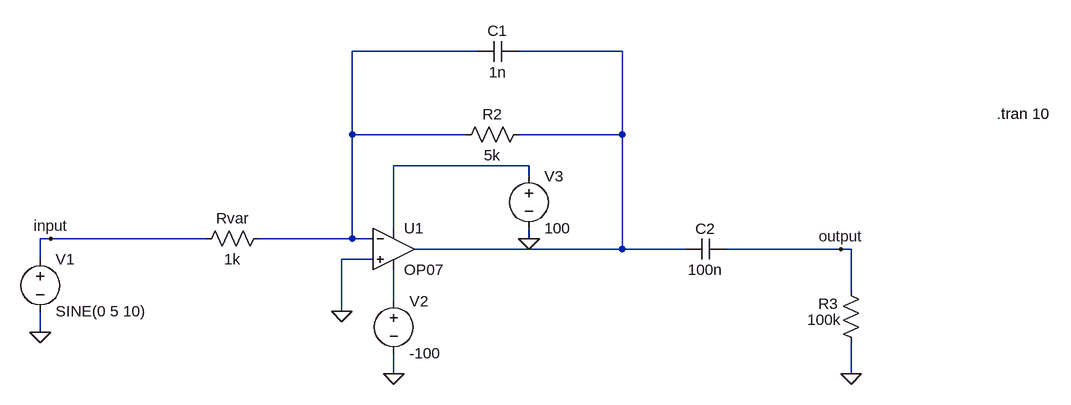
[diagram p0: schematic Tremolo.asc]
Tremolo.asc, the LTspice schematic file:
Version 4
SHEET 1 1456 680
WIRE 288 -112 96 -112
WIRE 512 -112 352 -112
WIRE 96 16 96 -112
WIRE 272 16 96 16
WIRE 512 16 512 -112
WIRE 512 16 352 16
WIRE 368 64 160 64
WIRE 368 80 368 64
WIRE 160 160 160 64
WIRE -368 176 -384 176
WIRE -128 176 -368 176
WIRE 96 176 96 16
WIRE 96 176 -48 176
WIRE 128 176 96 176
WIRE 368 176 368 160
WIRE 512 192 512 16
WIRE 512 192 192 192
WIRE 608 192 512 192
WIRE 848 192 672 192
WIRE 864 192 848 192
WIRE -384 208 -384 176
WIRE 128 208 80 208
WIRE 864 256 864 192
WIRE 160 272 160 224
WIRE 80 288 80 208
WIRE -384 320 -384 288
WIRE 160 384 160 352
WIRE 864 384 864 336
FLAG 80 288 0
FLAG 864 384 0
FLAG -384 320 0
FLAG 848 192 output
FLAG -368 176 input
FLAG 368 176 0
FLAG 160 384 0
SYMBOL res -32 160 R90
WINDOW 0 0 56 VBottom 2
WINDOW 3 32 56 VTop 2
SYMATTR InstName Rvar
SYMATTR Value 1k
SYMBOL res 368 0 R90
WINDOW 0 0 56 VBottom 2
WINDOW 3 32 56 VTop 2
SYMATTR InstName R2
SYMATTR Value 5k
SYMBOL res 880 352 R180
WINDOW 0 36 76 Left 2
WINDOW 3 31 51 Left 2
SYMATTR InstName R3
SYMATTR Value 100k
SYMBOL cap 352 -128 R90
WINDOW 0 0 32 VBottom 2
WINDOW 3 32 32 VTop 2
SYMATTR InstName C1
SYMATTR Value 1n
SYMBOL cap 672 176 R90
WINDOW 0 0 32 VBottom 2
WINDOW 3 32 32 VTop 2
SYMATTR InstName C2
SYMATTR Value 100n
SYMBOL voltage -384 192 R0
WINDOW 123 0 0 Left 0
WINDOW 39 0 0 Left 0
SYMATTR InstName V1
SYMATTR Value SINE(0 5 10)
SYMBOL OP07 160 128 R0
SYMATTR InstName U1
SYMBOL voltage 160 256 R0
SYMATTR InstName V2
SYMATTR Value -100
SYMBOL voltage 368 64 R0
WINDOW 123 0 0 Left 0
WINDOW 39 0 0 Left 0
SYMATTR InstName V3
SYMATTR Value 100
TEXT 1088 -16 Left 2 !.tran 10

The netlist it stands for:
* Tremolo.asc
Rvar N001 input 1k
R2 N002 N001 5k
R3 0 output 100k
C1 N002 N001 1n
C2 output N002 100n
V1 input 0 SINE(0 5 10)
XU1 0 N001 N003 N004 N002 LT1001  ; OP07, pins In+ In- V+ V- OUT
V2 N004 0 -100
V3 N003 0 100
.tran 10
.lib LTC.lib
.backanno
.end